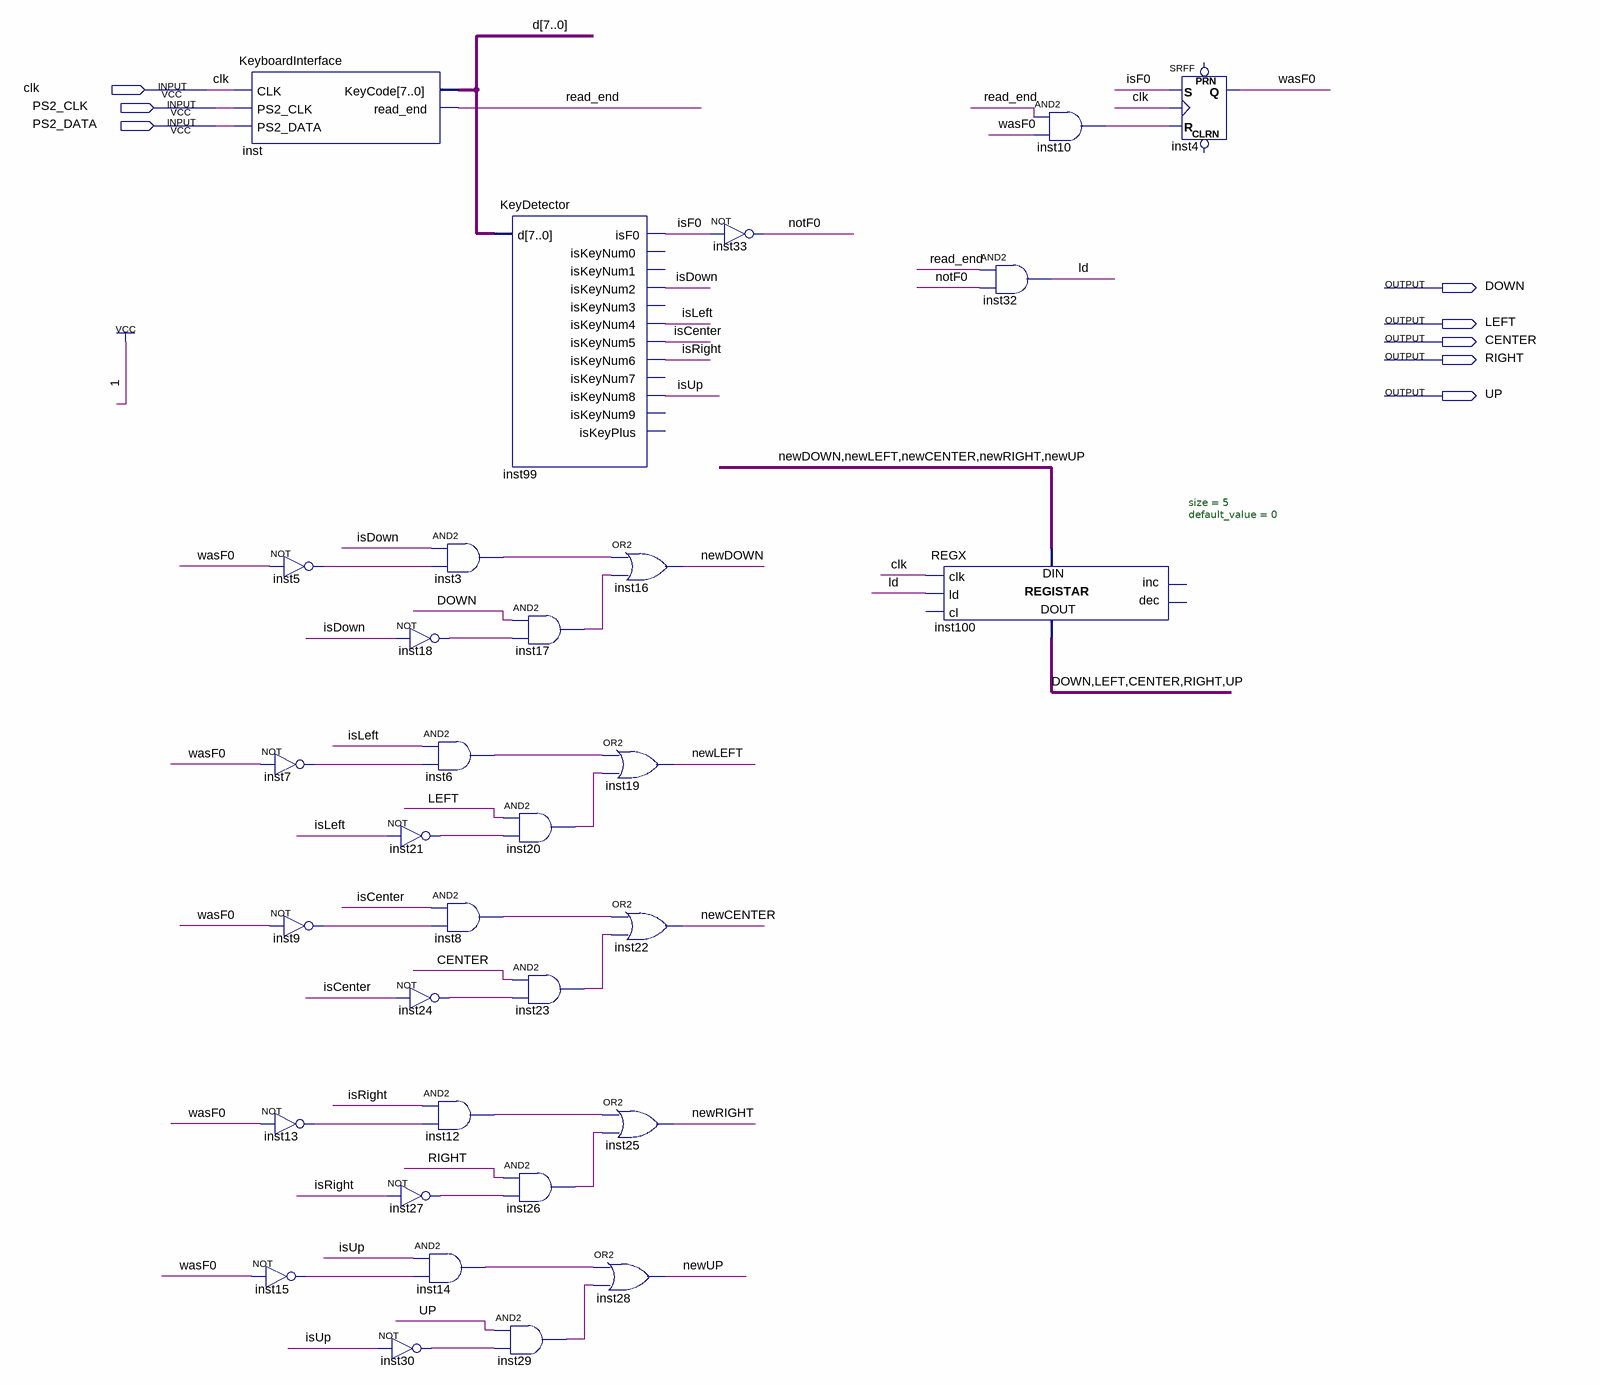
[diagram p0: schematic sheet]
// Quartus schematic keyMap.bdf as structural Verilog: 32 symbols, 8 pins
module keyMap (
  input  clk,
  input  PS2_CLK,
  input  PS2_DATA,
  output DOWN,
  output LEFT,
  output CENTER,
  output RIGHT,
  output UP
);

  wire inst3_out, inst5_out, inst6_out, inst7_out, inst8_out, inst9_out, inst10_out, inst12_out, inst13_out,
       inst14_out, inst15_out, inst17_out, inst18_out, inst20_out, inst21_out, inst23_out, inst24_out,
       inst26_out, inst27_out, inst29_out, inst30_out, isCenter, isDown, isF0, isLeft, isRight, isUp, ld,
       newCENTER, newDOWN, newLEFT, newRIGHT, newUP, notF0, read_end, wasF0;
  wire [7:0] d;

  KeyboardInterface inst (.CLK(clk), .PS2_CLK(PS2_CLK), .PS2_DATA(PS2_DATA), .KeyCode(d), .read_end(read_end));
  not inst5 (inst5_out, wasF0);
  not inst7 (inst7_out, wasF0);
  not inst9 (inst9_out, wasF0);
  not inst13 (inst13_out, wasF0);
  not inst15 (inst15_out, wasF0);
  not inst18 (inst18_out, isDown);
  and inst6 (inst6_out, isLeft, inst7_out);
  not inst21 (inst21_out, isLeft);
  not inst24 (inst24_out, isCenter);
  and inst12 (inst12_out, isRight, inst13_out);
  not inst27 (inst27_out, isRight);
  and inst14 (inst14_out, isUp, inst15_out);
  not inst30 (inst30_out, isUp);
  KeyDetector inst99 (
    .d(d), .isF0(isF0), .isKeyNum2(isDown), .isKeyNum4(isLeft), .isKeyNum5(isCenter), .isKeyNum6(isRight),
    .isKeyNum8(isUp));  // open: isKeyNum0, isKeyNum1, isKeyNum3, isKeyNum7, isKeyNum9, isKeyPlus
  and inst3 (inst3_out, isDown, inst5_out);
  and inst8 (inst8_out, isCenter, inst9_out);
  and inst29 (inst29_out, UP, inst30_out);
  and inst17 (inst17_out, DOWN, inst18_out);
  and inst20 (inst20_out, LEFT, inst21_out);
  and inst23 (inst23_out, CENTER, inst24_out);
  and inst26 (inst26_out, RIGHT, inst27_out);
  or inst16 (newDOWN, inst3_out, inst17_out);
  or inst19 (newLEFT, inst6_out, inst20_out);
  or inst22 (newCENTER, inst8_out, inst23_out);
  or inst25 (newRIGHT, inst12_out, inst26_out);
  or inst28 (newUP, inst14_out, inst29_out);
  not inst33 (notF0, isF0);
  REGX #(.size(5), .default_value(0)) inst100 (
    .clk(clk), .ld(ld), .data_in({newDOWN, newLEFT, newCENTER, newRIGHT, newUP}),
    .data_out({DOWN, LEFT, CENTER, RIGHT, UP}));  // open: cl, inc, dec
  and inst32 (ld, read_end, notF0);
  and inst10 (inst10_out, read_end, wasF0);
  SRFF inst4 (.S(isF0), .R(inst10_out), .CLK(clk), .Q(wasF0));  // open: PRN, CLRN
endmodule
